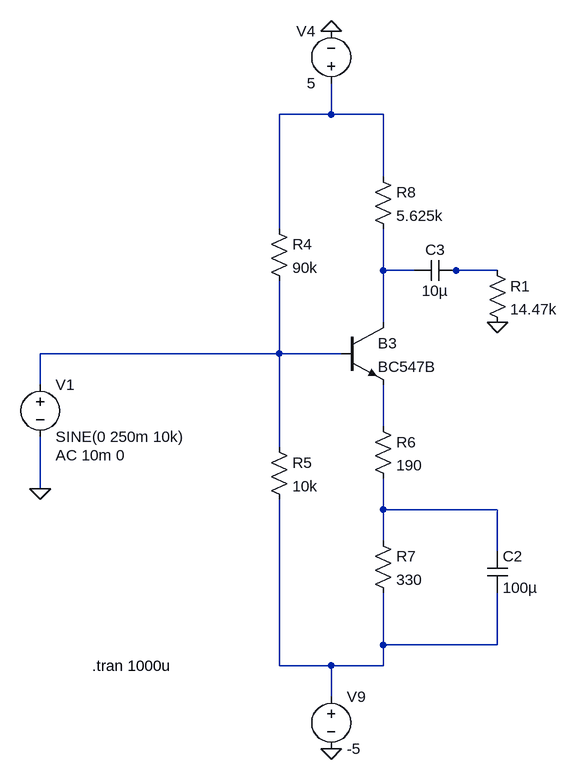
[diagram p0: schematic Gain_stage.asc]
Gain_stage.asc, the LTspice schematic file:
Version 4.1
SHEET 1 5036 884
WIRE 752 -128 752 -176
WIRE 752 -128 672 -128
WIRE 832 -128 752 -128
WIRE 832 -32 832 -128
WIRE 672 48 672 -128
WIRE 832 112 832 48
WIRE 880 112 832 112
WIRE 944 112 928 112
WIRE 1008 112 944 112
WIRE 832 192 832 112
WIRE 672 240 672 128
WIRE 672 240 304 240
WIRE 768 240 672 240
WIRE 304 288 304 240
WIRE 832 352 832 288
WIRE 672 384 672 240
WIRE 304 448 304 368
WIRE 832 480 832 432
WIRE 1008 480 832 480
WIRE 832 528 832 480
WIRE 1008 544 1008 480
WIRE 832 688 832 608
WIRE 1008 688 1008 608
WIRE 1008 688 832 688
WIRE 672 720 672 464
WIRE 752 720 672 720
WIRE 832 720 832 688
WIRE 832 720 752 720
WIRE 752 768 752 720
FLAG 304 448 0
FLAG 752 848 0
FLAG 752 -256 0
FLAG 1008 192 0
SYMBOL voltage 304 272 R0
WINDOW 123 24 124 Left 2
WINDOW 39 0 0 Left 0
SYMATTR Value2 AC 10m 0
SYMATTR InstName V1
SYMATTR Value SINE(0 250m 10k)
SYMBOL npn 768 192 R0
SYMATTR InstName B3
SYMATTR Value BC547B
SYMBOL res 656 32 R0
SYMATTR InstName R4
SYMATTR Value 90k
SYMBOL res 656 368 R0
SYMATTR InstName R5
SYMATTR Value 10k
SYMBOL voltage 752 -160 R180
WINDOW 0 24 96 Left 2
WINDOW 3 24 16 Left 2
WINDOW 123 0 0 Left 0
WINDOW 39 0 0 Left 0
SYMATTR InstName V4
SYMATTR Value 5
SYMBOL res 816 -48 R0
SYMATTR InstName R8
SYMATTR Value 5.625k
SYMBOL voltage 752 752 R0
WINDOW 123 0 0 Left 0
WINDOW 39 0 0 Left 0
SYMATTR InstName V9
SYMATTR Value -5
SYMBOL cap 944 96 R90
WINDOW 0 0 32 VBottom 2
WINDOW 3 32 32 VTop 2
SYMATTR InstName C3
SYMATTR Value 10µ
SYMBOL res 816 336 R0
SYMATTR InstName R6
SYMATTR Value 190
SYMBOL res 816 512 R0
SYMATTR InstName R7
SYMATTR Value 330
SYMBOL cap 992 544 R0
SYMATTR InstName C2
SYMATTR Value 100µ
SYMBOL res 992 96 R0
SYMATTR InstName R1
SYMATTR Value 14.47k
TEXT 384 720 Left 2 !.tran 1000u

The netlist it stands for:
* Gain_stage.asc
V1 N004 0 SINE(0 250m 10k) AC 10m 0
Q§B3 N002 N004 N005 0 BC547B
R4 N001 N004 90k
R5 N004 N007 10k
V4 N001 0 5
R8 N001 N002 5.625k
V9 N007 0 -5
C3 N003 N002 10µ
R6 N005 N006 190
R7 N006 N007 330
C2 N006 N007 100µ
R1 N003 0 14.47k
.model NPN NPN
.model PNP PNP
.lib standard.bjt
.tran 1000u
.backanno
.end